# EAGLE schematic test_controller (EAGLE 7.1.0)
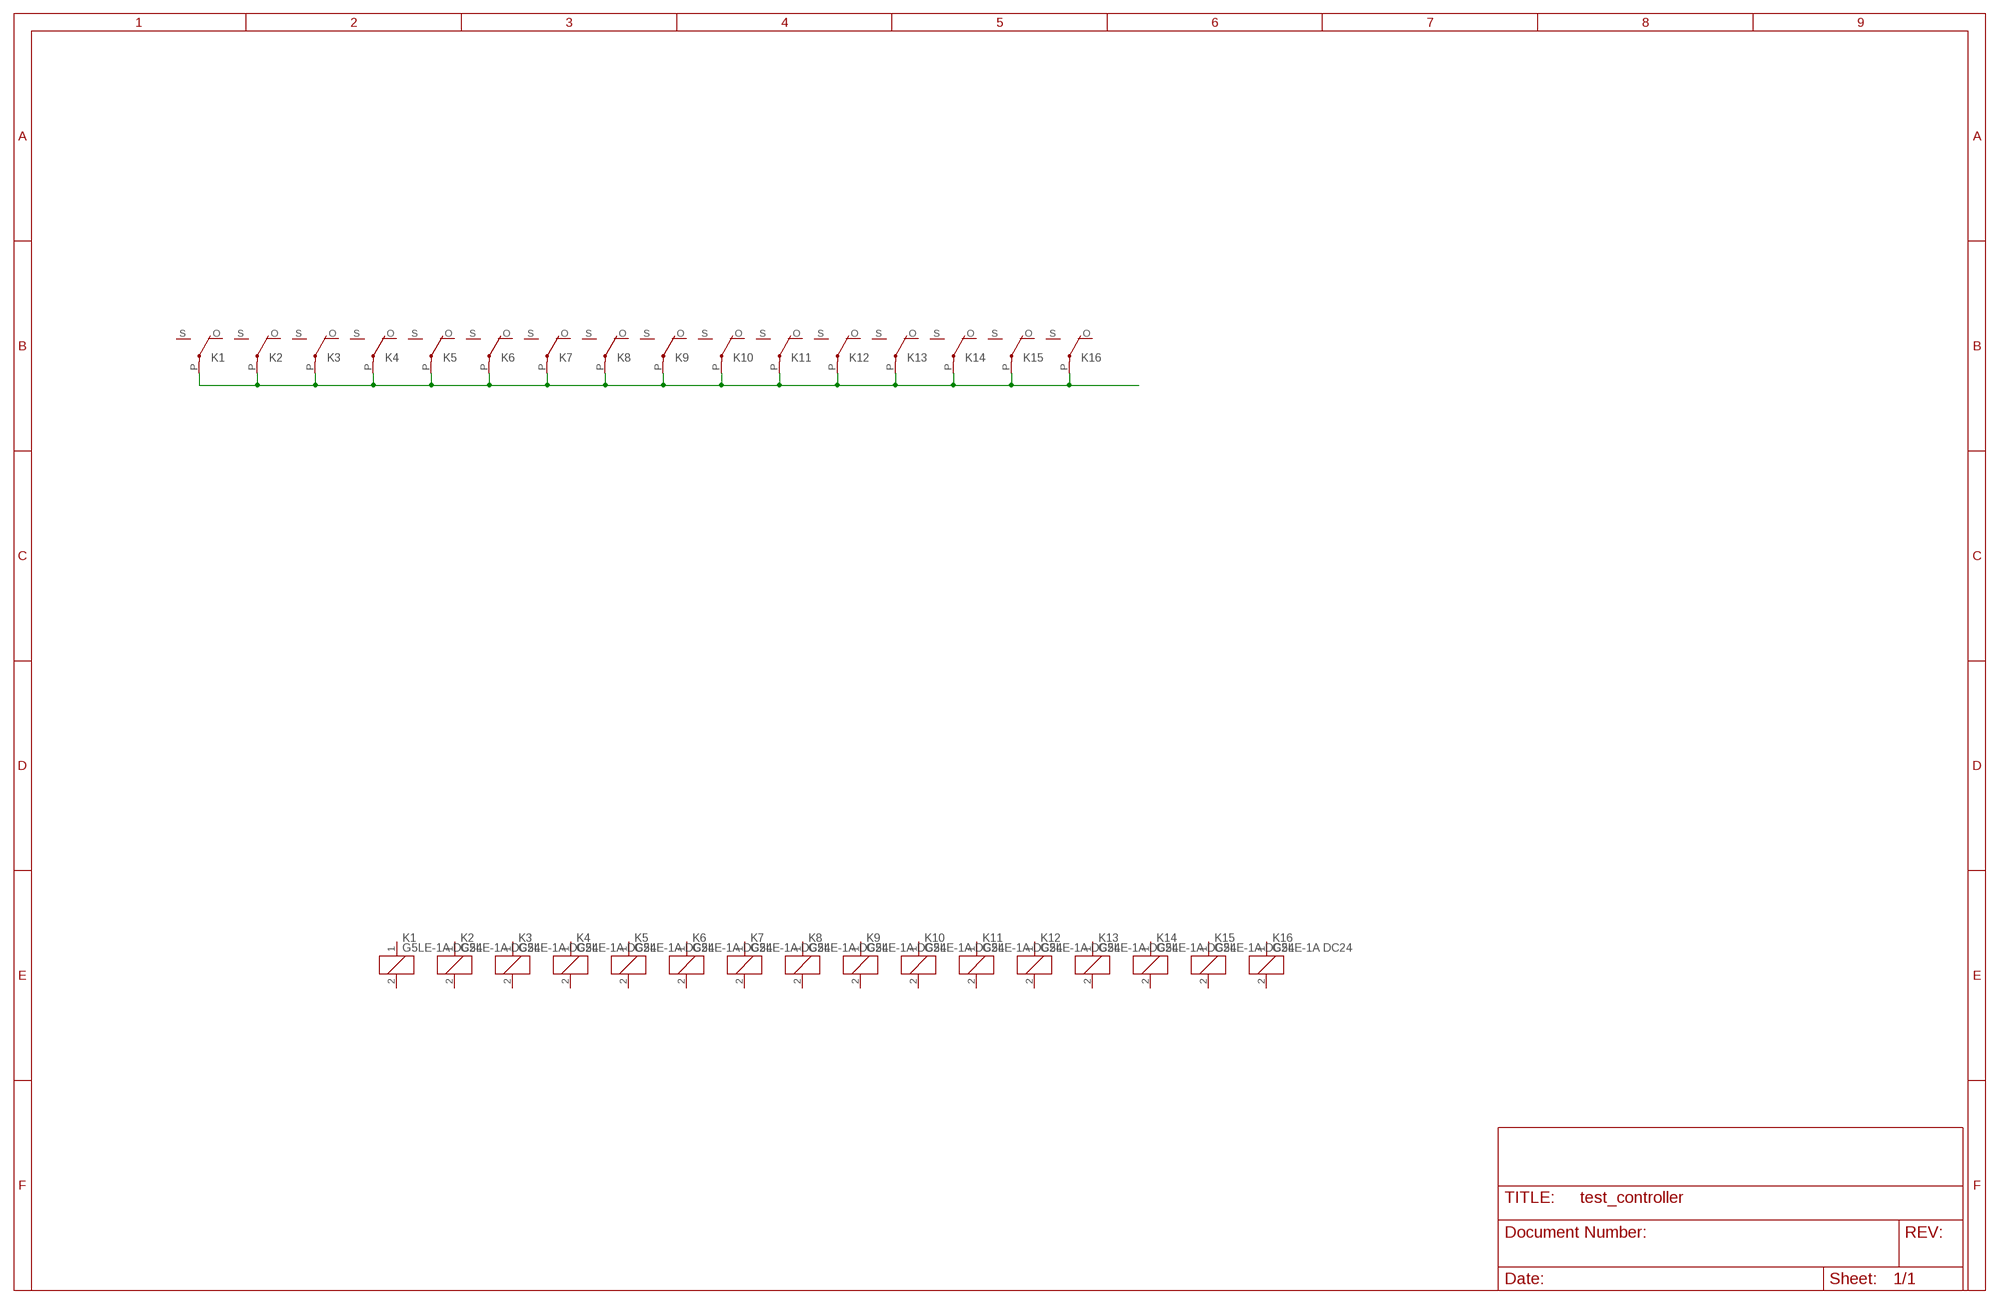
[diagram p0: schematic, sheet 1]

## Parts
K1  G5LE-1A DC24  G5LE  [G5LE]
K2  G5LE-1A DC24  G5LE  [G5LE]
K3  G5LE-1A DC24  G5LE  [G5LE]
K4  G5LE-1A DC24  G5LE  [G5LE]
K5  G5LE-1A DC24  G5LE  [G5LE]
K6  G5LE-1A DC24  G5LE  [G5LE]
K7  G5LE-1A DC24  G5LE  [G5LE]
K8  G5LE-1A DC24  G5LE  [G5LE]
K9  G5LE-1A DC24  G5LE  [G5LE]
K10  G5LE-1A DC24  G5LE  [G5LE]
K11  G5LE-1A DC24  G5LE  [G5LE]
K12  G5LE-1A DC24  G5LE  [G5LE]
K13  G5LE-1A DC24  G5LE  [G5LE]
K14  G5LE-1A DC24  G5LE  [G5LE]
K15  G5LE-1A DC24  G5LE  [G5LE]
K16  G5LE-1A DC24  G5LE  [G5LE]

## Nets
N$1: K1.P(2:P) K2.P(2:P) K3.P(2:P) K4.P(2:P) K5.P(2:P) K6.P(2:P) K7.P(2:P) K8.P(2:P) K9.P(2:P) K10.P(2:P) K11.P(2:P) K12.P(2:P) K13.P(2:P) K14.P(2:P) K15.P(2:P) K16.P(2:P)
Unconnected: K1.1 K1.2 K1.O(2:O) K1.S(2:S) K2.1 K2.2 K2.O(2:O) K2.S(2:S) K3.1 K3.2 K3.O(2:O) K3.S(2:S) K4.1 K4.2 K4.O(2:O) K4.S(2:S) K5.1 K5.2 K5.O(2:O) K5.S(2:S) K6.1 K6.2 K6.O(2:O) K6.S(2:S) K7.1 K7.2 K7.O(2:O) K7.S(2:S) K8.1 K8.2 K8.O(2:O) K8.S(2:S) K9.1 K9.2 K9.O(2:O) K9.S(2:S) K10.1 K10.2 K10.O(2:O) K10.S(2:S) K11.1 K11.2 K11.O(2:O) K11.S(2:S) K12.1 K12.2 K12.O(2:O) K12.S(2:S) K13.1 K13.2 K13.O(2:O) K13.S(2:S) K14.1 K14.2 K14.O(2:O) K14.S(2:S) K15.1 K15.2 K15.O(2:O) K15.S(2:S) K16.1 K16.2 K16.O(2:O) K16.S(2:S)

## Library data of the parts
K1-K16 = relay:G5LE: RELAY 1 x switch, 10 A/120 V AC, 8 A/30 V DC, Omron